# EAGLE design LED_Indicator (EAGLE 9.6.2)
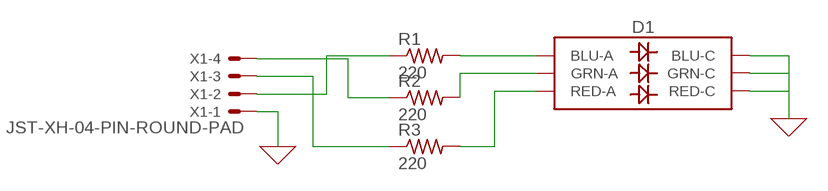
[diagram p0: schematic, sheet 1]

## Parts
D1  LED-RGBBRG  [LED-TRICOLOR-5050]
R1  220  R-US_R1206  [R1206]
R2  220  R-US_R1206  [R1206]
R3  220  R-US_R1206  [R1206]
X1  JST-XH-04-PIN-ROUND-PAD  [JST-XH-04-PACKAGE-ROUND-PAD]

## Nets
0: D1.1(BLU-C) D1.2(RED-C) D1.3(GRN-C) X1.1 ; supply symbol labelled GND
N$1: D1.6(BLU-A) R1.2
N$2: D1.4(GRN-A) R2.2
N$3: D1.5(RED-A) R3.2
N$4: R1.1 X1.2
N$5: R2.1 X1.4
N$6: R3.1 X1.3

## Library data of the parts
D1 = SparkFun-LED:LED-RGB: LED-RGB 6 pin RGB LED (no common connector) Packages: PLCC-6 LED-TRICOLOR-5050 - No built-in IC SparkFun Products: Digital Sandbox <https://www.sparkfun.com/products/12651> LED- SMD RGB <https://www.sparkfun.com/products/10866>; PROD_ID: DIO-16048
R1-R3 = rcl:R-US_: RESISTOR, American symbol; SPICEPREFIX: R
X1 = Rembrandt Electronics - JST XH Connectors v1-0:JST-XH-04-PIN: JST XH Connector 2 Pin Wire to board connector. Pitch: 2,54 mm, (0.100") Number of pins: 4 Created by Rembrandt Electronics www.rembrandtelectronics.com

## Board
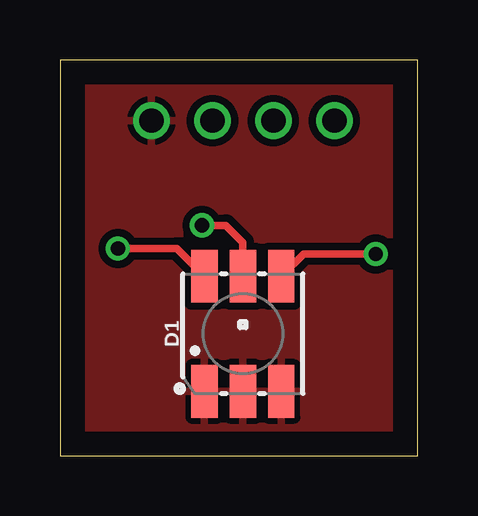
[diagram p1: board, top side]
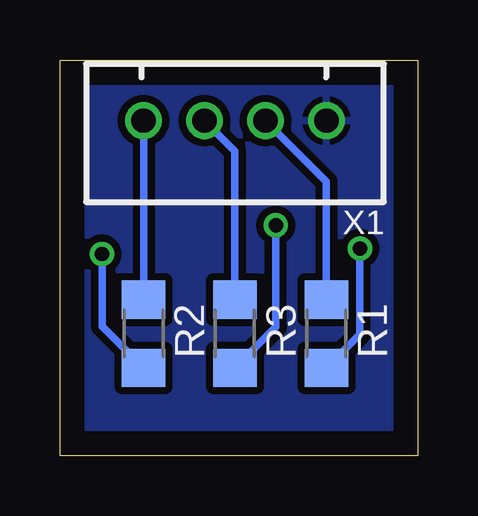
[diagram p2: board, bottom side, seen from below]

Size 14.91 x 16.5 mm. Coordinates in mm from the lower left corner, seen from the top.
Outline: 0,0 14.91,0 14.91,16.5 0,16.5 0,0
Copper layers (1*16): Top 0.035mm / dielectric 1.5mm / Bottom 0.035mm
Design rules "default *": minimum track width 12mil, minimum drill 0.6mm, track to track 12mil, track to pad 12mil, pad to pad 12mil, via to via 12mil, smd to smd 12mil, copper to edge 40mil, drill to drill 6mil, minimum pad ring 10mil, minimum via ring 8mil, stop-mask expansion 4mil, vias tented up to drill 0mil, thermal gap 10mil

### Footprints (pad centres in the part's own frame; a part is rotated, then mirrored left to right if it is on the bottom)
LED-TRICOLOR-5050 = smd 2.2 x 1.1: 1 -2.4,1.6; 2 -2.4,0; 3 -2.4,-1.6; 4 2.4,-1.6; 5 2.4,0; 6 2.4,1.6
R1206 = smd 1.6 x 1.803: 1 -1.422,0; 2 1.422,0
JST-XH-04-PACKAGE-ROUND-PAD = drill 1.016: 1 -3.81,0; 2 -1.27,0; 3 1.27,0; 4 3.81,0

### Placement (x,y rotation side)
D1  7.62,5.08 90 top
R1  3.81,5.08 270 bottom
R2  11.43,5.08 270 bottom
R3  7.62,5.08 270 bottom
X1  7.62,13.97 180 bottom

### Tracks (layer width: path | path; a pad name or v marks a point on that pad's centre or on a via)
0
  Top 0.305: D1.1 6.02,2.19
  pour Bottom: 0,0 0,16.51 15.24,16.51 15.24,0
  pour Top: 0,0 0,16.51 15.24,16.51 15.24,0
N$1  (via drill 0.6)
  Top 0.305: v2.41,8.64 4.86,8.64 D1.6
  Bottom 0.305: R1.2 2.41,5.05 v2.41,8.64
N$2  (via drill 0.6)
  Top 0.305: v13.16,8.41 10.15,8.41 D1.4
  Bottom 0.305: R2.2 13.16,5.38 v13.16,8.41
N$3  (via drill 0.6)
  Top 0.305: v5.92,9.6 6.91,9.6 7.62,8.89 D1.5
  Bottom 0.305: R3.2 5.92,5.36 v5.92,9.6
N$4
  Bottom 0.305: X1.2 3.81,11.43 R1.1
N$5
  Bottom 0.305: X1.4 R2.1
N$6
  Bottom 0.305: X1.3 7.62,12.7 R3.1